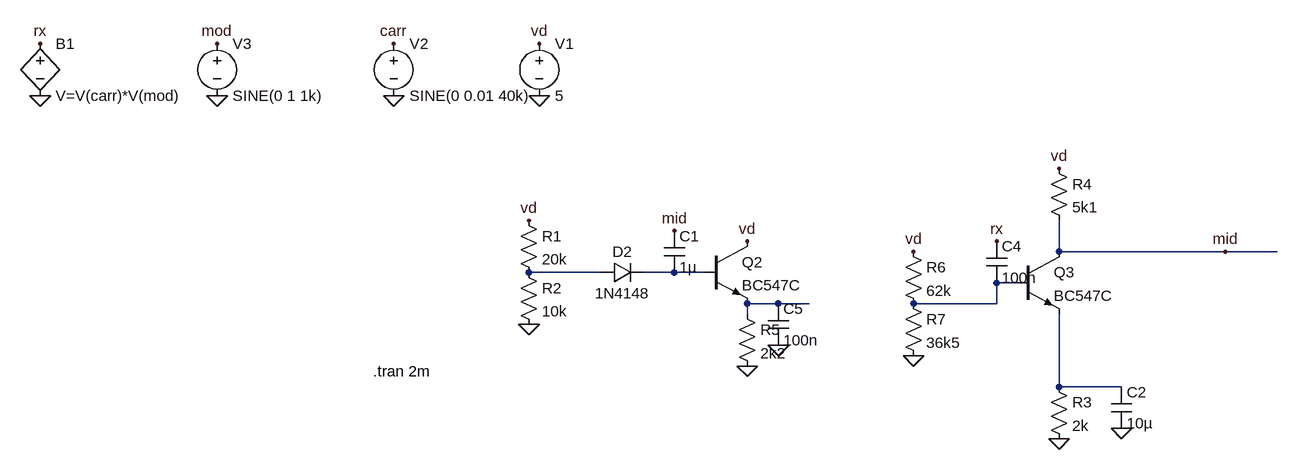
[diagram p0: schematic env_det.asc]
env_det.asc, the LTspice schematic file:
Version 4
SHEET 1 1124 680
WIRE 656 144 656 96
WIRE 912 144 656 144
WIRE 992 144 912 144
WIRE -48 176 -160 176
WIRE 64 176 16 176
WIRE 112 176 64 176
WIRE 592 192 560 192
WIRE 224 224 176 224
WIRE 272 224 224 224
WIRE 560 224 560 192
WIRE 560 224 432 224
WIRE 176 240 176 224
WIRE 656 352 656 240
WIRE 752 352 656 352
FLAG -160 256 0
FLAG 656 432 0
FLAG -368 -96 0
FLAG -144 -96 0
FLAG -144 -176 vd
FLAG 656 16 vd
FLAG -160 96 vd
FLAG -640 -96 0
FLAG -368 -176 carr
FLAG -640 -176 mod
FLAG -912 -96 0
FLAG -912 -176 rx
FLAG 64 112 mid
FLAG 176 320 0
FLAG 176 128 vd
FLAG 432 304 0
FLAG 432 144 vd
FLAG 912 144 mid
FLAG 224 288 0
FLAG 752 416 0
FLAG 560 128 rx
SYMBOL res -176 80 R0
SYMATTR InstName R1
SYMATTR Value 20k
SYMBOL res -176 160 R0
SYMATTR InstName R2
SYMATTR Value 10k
SYMBOL res 640 0 R0
SYMATTR InstName R4
SYMATTR Value 5k1
SYMBOL voltage -144 -192 R0
WINDOW 123 0 0 Left 0
WINDOW 39 0 0 Left 0
SYMATTR InstName V1
SYMATTR Value 5
SYMBOL voltage -368 -192 R0
WINDOW 123 0 0 Left 0
WINDOW 39 0 0 Left 0
SYMATTR InstName V2
SYMATTR Value SINE(0 0.01 40k)
SYMBOL cap 48 112 R0
SYMATTR InstName C1
SYMATTR Value 1µ
SYMBOL voltage -640 -192 R0
WINDOW 123 0 0 Left 0
WINDOW 39 0 0 Left 0
SYMATTR InstName V3
SYMATTR Value SINE(0 1 1k)
SYMBOL bv -912 -192 R0
SYMATTR InstName B1
SYMATTR Value V=V(carr)*V(mod)
SYMBOL npn 112 128 R0
SYMATTR InstName Q2
SYMATTR Value BC547C
SYMBOL res 160 224 R0
SYMATTR InstName R5
SYMATTR Value 2k2
SYMBOL res 416 128 R0
SYMATTR InstName R6
SYMATTR Value 62k
SYMBOL res 416 208 R0
SYMATTR InstName R7
SYMATTR Value 36k5
SYMBOL cap 544 128 R0
SYMATTR InstName C4
SYMATTR Value 100n
SYMBOL res 640 336 R0
SYMATTR InstName R3
SYMATTR Value 2k
SYMBOL cap 736 352 R0
SYMATTR InstName C2
SYMATTR Value 10µ
SYMBOL diode -48 192 R270
WINDOW 0 32 32 VTop 2
WINDOW 3 0 32 VBottom 2
SYMATTR InstName D2
SYMATTR Value 1N4148
SYMBOL cap 208 224 R0
SYMATTR InstName C5
SYMATTR Value 100n
SYMBOL npn 592 144 R0
SYMATTR InstName Q3
SYMATTR Value BC547C
TEXT -400 328 Left 2 !.tran 2m

The netlist it stands for:
* env_det.asc
R1 vd N001 20k
R2 N001 0 10k
R4 vd mid 5k1
V1 vd 0 5
V2 carr 0 SINE(0 0.01 40k)
C1 mid N002 1µ
V3 mod 0 SINE(0 1 1k)
B1 rx 0 V=V(carr)*V(mod)
Q2 vd N002 N004 0 BC547C
R5 N004 0 2k2
R6 vd N003 62k
R7 N003 0 36k5
C4 rx N003 100n
R3 N005 0 2k
C2 N005 0 10µ
D2 N001 N002 1N4148
C5 N004 0 100n
Q3 mid N003 N005 0 BC547C
.model D D
.lib standard.dio
.model NPN NPN
.model PNP PNP
.lib standard.bjt
.tran 2m
.backanno
.end